# Altium schematic sheet LEDs.SchDoc
size A4
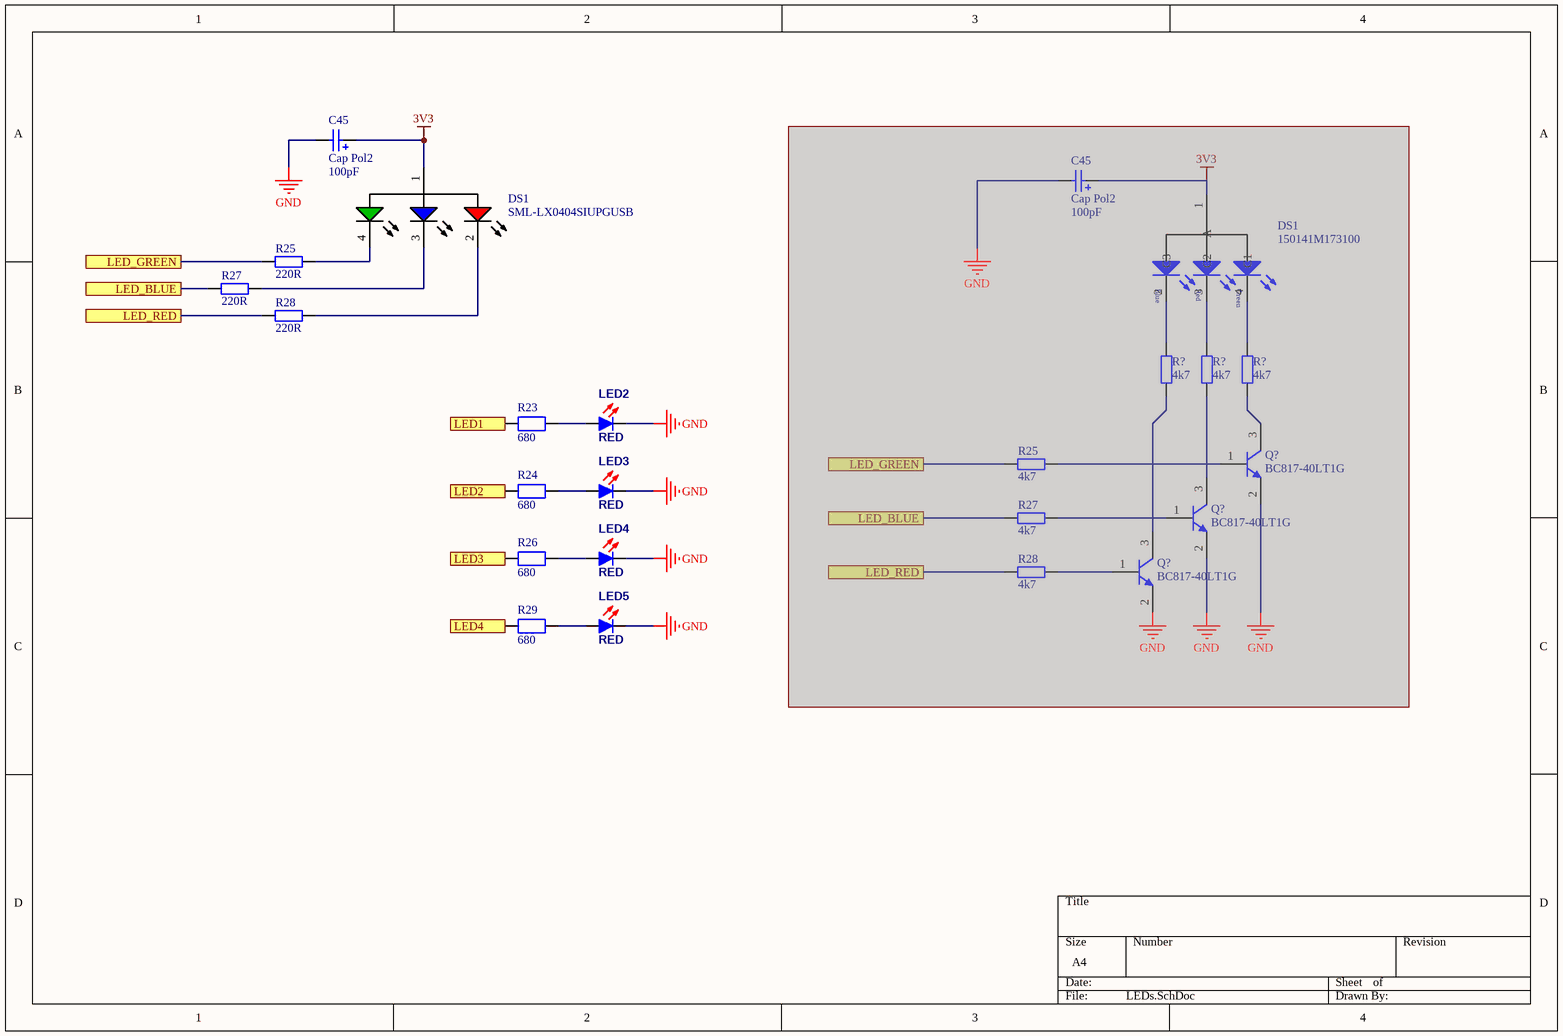
[diagram p0: LEDs.SchDoc]

## Parts
(Parts that share a designator on the sheet are numbered #1, #2 ... from top to bottom, then left to right.)
C45#1  Cap Pol2  value 100pF  [0603_CAP_NPOL]
C45#2  Cap Pol2  value 100pF  [0603_CAP_NPOL]  (masked out: inside a compile mask, not in the netlist)
DS1#1  SML-LX0404SIUPGUSB  [LUMX-SML-LX0404SIUPGUSB-4_V]
DS1#2  150141M173100  [3528_A]  (masked out: inside a compile mask, not in the netlist)
LED2  RED  [LED0805R]
LED3  RED  [LED0805R]
LED4  RED  [LED0805R]
LED5  RED  [LED0805R]
Q?#1  BC817-40LT1G  [ONSC-SOT-23-3-318-08_V]  (masked out: inside a compile mask, not in the netlist)
Q?#2  BC817-40LT1G  [ONSC-SOT-23-3-318-08_V]  (masked out: inside a compile mask, not in the netlist)
Q?#3  BC817-40LT1G  [ONSC-SOT-23-3-318-08_V]  (masked out: inside a compile mask, not in the netlist)
R23  680  [0402_RES]
R24  680  [0402_RES]
R25#1  value 220R  [0402_RES]  (hidden comment: Res2)
R25#2  value 4k7  [0402_RES]  (hidden comment: Res2)  (masked out: inside a compile mask, not in the netlist)
R26  680  [0402_RES]
R27#1  value 220R  [0402_RES]
R27#2  value 4k7  [0402_RES]  (masked out: inside a compile mask, not in the netlist)
R28#1  value 220R  [0402_RES]
R28#2  value 4k7  [0402_RES]  (masked out: inside a compile mask, not in the netlist)
R29  680  [0402_RES]
R?#1  value 4k7  [0402_RES]  (hidden comment: Res2)  (masked out: inside a compile mask, not in the netlist)
R?#2  value 4k7  [0402_RES]  (hidden comment: Res2)  (masked out: inside a compile mask, not in the netlist)
R?#3  value 4k7  [0402_RES]  (hidden comment: Res2)  (masked out: inside a compile mask, not in the netlist)

## Ports
LED1, LED2, LED3, LED4, LED_BLUE, LED_GREEN, LED_RED

## Nets
3V3: C45#1.1 DS1#1.1(A)
GND: C45#1.2 LED2.2(K) LED3.2(K) LED4.2(K) LED5.2(K)
LED1: R23.1 ; port LED1
LED2: R24.1 ; port LED2
LED3: R26.1 ; port LED3
LED4: R29.1 ; port LED4
LED_BLUE: R27#1.1 ; port LED_BLUE
LED_GREEN: R25#1.1 ; port LED_GREEN
LED_RED: R28#1.1 ; port LED_RED
NetDS1#1_2: DS1#1.2(R) R28#1.2
NetDS1#1_3: DS1#1.3(B) R27#1.2
NetDS1#1_4: DS1#1.4(G) R25#1.2
NetLED2_1: LED2.1(A) R23.2
NetLED3_1: LED3.1(A) R24.2
NetLED4_1: LED4.1(A) R26.2
NetLED5_1: LED5.1(A) R29.2

## Notes on the sheet
- (in symbol CMP-1431-00001-1) Blue; Red; Green

## Library data of the parts
C45#1 C45#2 = Cap Pol2: Polarized Capacitor (Axial); Published: 8-Jun-2000; LatestRevisionDate: 17-Jul-2002; LatestRevisionNote: Re-released for DXP Platform.; PackageReference: POLAR0.8; Publisher: Altium Limited; PackageDescription: Polarized Capacitor; 2 Leads
DS1#1 = CMP-2000-07119-1: Full Color, Water Clear Lens, -40 to 85 degC, 4-Pin SML (0404), RoHS, Tape and Reel; LED Size: 1mmx1mm; Brand: Lumex; Luminous Intensity: 30mcd; Forward Current: 2mA; Viewing Angle: 120deg; Illumination Color: RGB; Package Version: Rev. B, 06/2015; Maximum Operating Temperature: +85C; Package Reference: 0404; PartNumber: SML-LX0404SIUPGUSB; Manufacturer: Lumex; Product Category: StandardLEDs-SMD; Lens Color/Style: WaterClear; Packaging: Reel; Minimum Operating Temperature: -40C; Datasheet Version: Rev. B, 06/2015; Datasheet URL: http://www.lumex.com/content/files/ProductAttachment/SML-LX0404SIUPGUSB.pdf; RoHS: Details; Package / Case: 0404; Mounting Technology: SurfaceMount; Package Description: 4-Pin Surface Mount Device, Body 1 x 1 mm, Pitch 0.85 mm; Factory Pack Quantity: 2000; Manufacturer URL: http://www.lumexinstruments.com/
DS1#2 = CMP-1431-00001-1: SMD Full-Color Top LED, WL-SFTW, Red & Green & Blue; Manufacturer: Wuerth Elektronik; PackageReference: 3528_A; PartNumber: 150141M173100; ComponentLink2Description: Datasheet; ComponentLink1URL: http://www.we-online.com; Color: Red & Green & Blue; ComponentLink1Description: Manufacturer URL; ComponentLink2URL: http://katalog.we-online.com/led/datasheet/150141M173100.pdf
LED2-LED5 = LED_RED: RED LED; Published: 04-Apr-2006
Q?#1-Q?#3 = CMP-1048-00019-1: General Purpose Transistor, NPN Silicon, 3-Pin SOT-23, Pb-Free, Tape and Reel; Manufacturer: On Semiconductor; fT Min (MHz): 100; IC Continuous (A): 0.5; ComponentLink2URL: http://www.onsemi.com/pub_link/Collateral/BC817-16LT1-D.PDF; DatasheetVersion: Rev. 12; ComponentLink3URL: http://www.onsemi.cn/pub_link/Collateral/318-08.PDF; ComponentLink3Description: Package Specification; ComponentLink1Description: Manufacturer URL; Mounting Technology: Surface Mount; ComponentLink1URL: http://www.onsemi.com/; Packing: Tape and Reel; ComponentLink2Description: Datasheet; Polarity: NPN; RoHS: TRUE; PackageVersion: Rev. AP, 11/2009; PartNumber: BC817-40LT1G; PackageDescription: 3-Pin Small Outline Transistor, Body 2.92 x 1.3 mm, Pitch 0.95 mm; PackageReference: SOT-23-3-318-08
R23 R24 R26 R29 = RES: Resistor
R25#1 R25#2 R27#1 R27#2 R28#1 R28#2 R?#1-R?#3 = Res2: Resistor; Published: 8-Jun-2000; LatestRevisionDate: 17-Jul-2002; LatestRevisionNote: Re-released for DXP Platform.; PackageReference: AXIAL-0.4; Publisher: Altium Limited; PackageDescription: Axial Device, Thru-Hole; 2 Leads; 0.4 in Pin Spacing